# Altium schematic sheet HL2SS.SchDoc
size A4
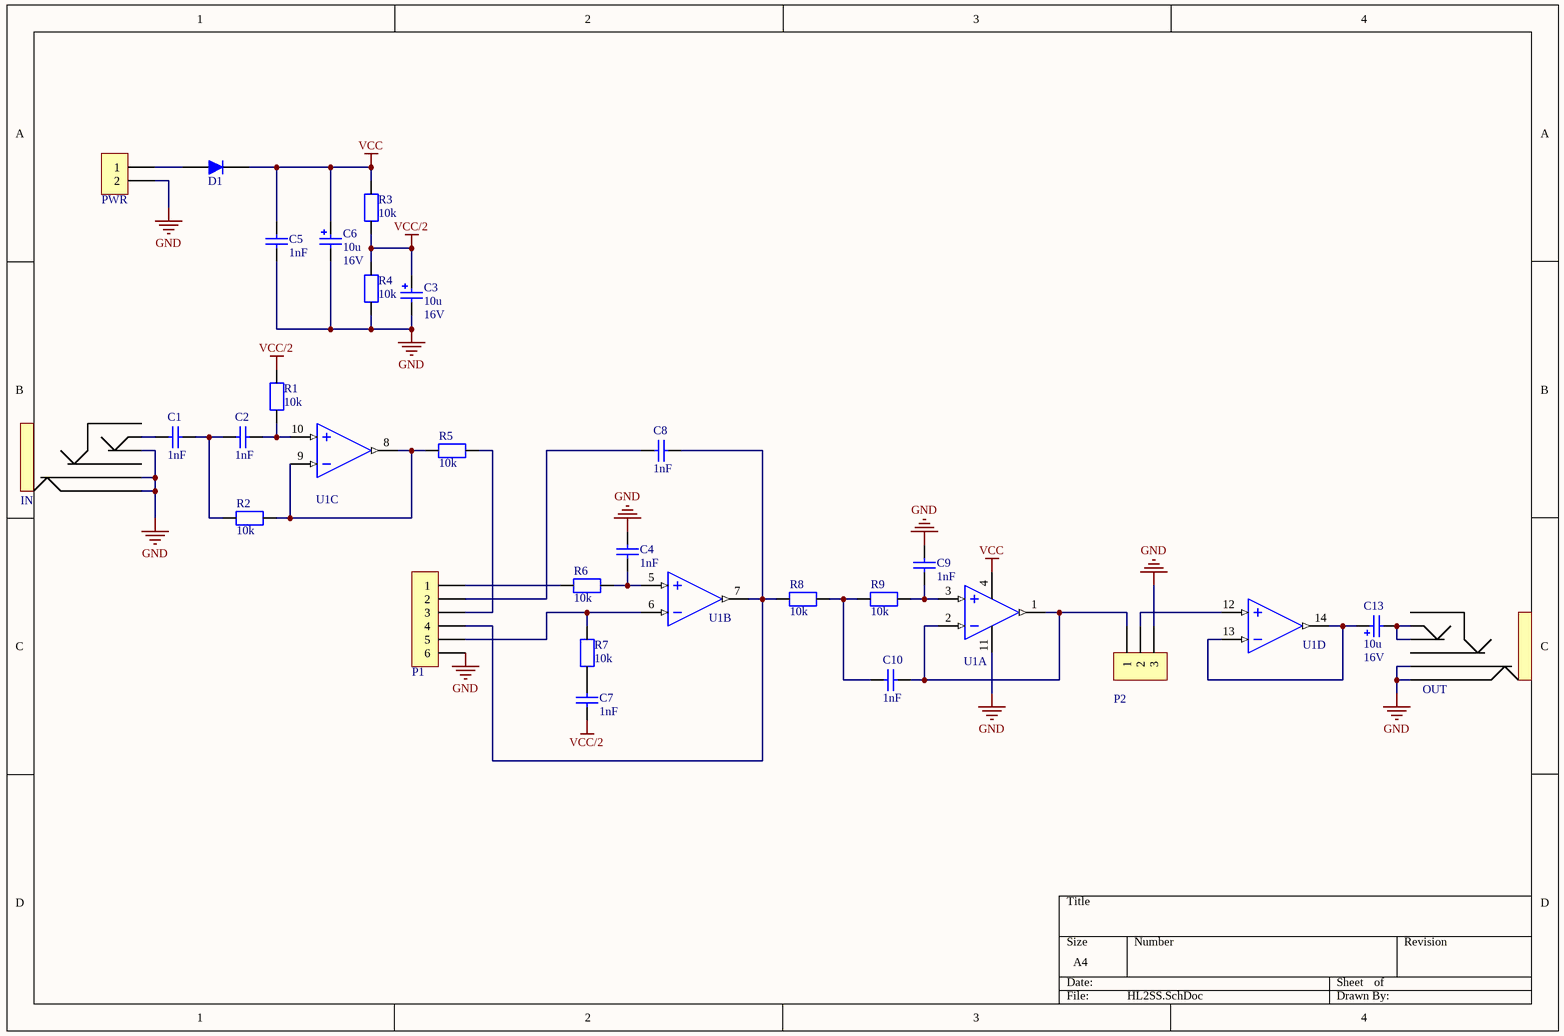
[diagram p0: HL2SS.SchDoc]

## Parts
C1  value 1nF  [0805_Capacitor]  (hidden comment: Capacitor)
C2  value 1nF  [0805_Capacitor]  (hidden comment: Capacitor)
C3  value 10u  Initial Voltage: 16V  [ELEC_RAD10]  (hidden comment: Electrolytic Capacitor)
C4  value 1nF  [0805_Capacitor]  (hidden comment: Capacitor)
C5  value 1nF  [0805_Capacitor]  (hidden comment: Capacitor)
C6  value 10u  Initial Voltage: 16V  [ELEC_RAD10]  (hidden comment: Electrolytic Capacitor)
C7  value 1nF  [0805_Capacitor]  (hidden comment: Capacitor)
C8  value 1nF  [0805_Capacitor]  (hidden comment: Capacitor)
C9  value 1nF  [0805_Capacitor]  (hidden comment: Capacitor)
C10  value 1nF  [0805_Capacitor]  (hidden comment: Capacitor)
C13  value 10u  Initial Voltage: 16V  [ELEC_RAD10]  (hidden comment: Electrolytic Capacitor)
D1  Diode  [DO35]  (value not drawn)
IN  Jack 6.3  [Jack 6.3]  (value not drawn)
OUT  Jack 6.3  [Jack 6.3]  (value not drawn)
P1  SIL-CONN-6  [SIL-CONN-6]  (value not drawn)
P2  SIL-CONN-3  [SIL-CONN-3]  (value not drawn)
PWR  SIL-CONN-2  [SIL-CONN-2]  (value not drawn)
R1  value 10k  [0805_Resistor]  (hidden comment: Resistor)
R2  value 10k  [0805_Resistor]  (hidden comment: Resistor)
R3  value 10k  [0805_Resistor]  (hidden comment: Resistor)
R4  value 10k  [0805_Resistor]  (hidden comment: Resistor)
R5  value 10k  [0805_Resistor]  (hidden comment: Resistor)
R6  value 10k  [0805_Resistor]  (hidden comment: Resistor)
R7  value 10k  [0805_Resistor]  (hidden comment: Resistor)
R8  value 10k  [0805_Resistor]  (hidden comment: Resistor)
R9  value 10k  [0805_Resistor]  (hidden comment: Resistor)
U1  TL074  [DIP14]  (value not drawn)  (parts A,B,C,D of 4)

## Nets
GND: C3.- C4.2 C5.1 C6.- C9.2 IN.2 IN.3 IN.4 OUT.3 OUT.4 P1.6 P2.3 PWR.2 R4.1 U1.11
VCC: C5.2 C6.+ D1.K R3.2 U1.4
VCC/2: C3.+ C7.1 R1.2 R3.1 R4.2
NetC1_1: C1.1 IN.1
NetC1_2: C1.2 C2.1 R2.1
NetC2_2: C2.2 R1.1 U1.10(+)
NetC4_1: C4.1 R6.2 U1.5(+)
NetC7_2: C7.2 R7.2
NetC8_1: C8.1 P1.2
NetC8_2: C8.2 P1.4 R8.1 U1.7(O)
NetC9_1: C9.1 R9.2 U1.3(+)
NetC10_1: C10.1 R8.2 R9.1
NetC10_2: C10.2 P2.1 U1.1(O) U1.2(-)
NetC13_+: C13.+ U1.13(-) U1.14(O)
NetC13_-: C13.- OUT.1 OUT.2
NetD1_A: D1.A PWR.1
NetP1_1: P1.1 R6.1
NetP1_3: P1.3 R5.2
NetP1_5: P1.5 R7.1 U1.6(-)
NetP2_2: P2.2 U1.12(+)
NetR2_2: R2.2 R5.1 U1.8(O) U1.9(-)

Not connected (* = marked no-connect by the designer): IN 5 6; OUT 5 6